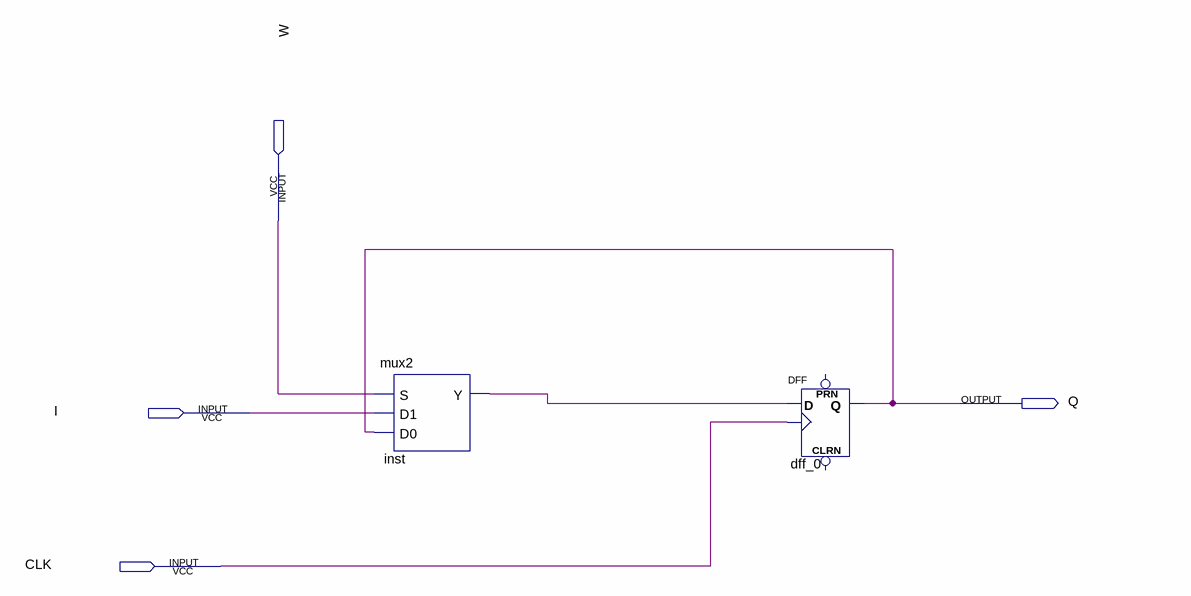
[diagram p0: schematic sheet]
// Quartus schematic register_1bit.bdf as structural Verilog: 2 symbols, 4 pins
module register_1bit (
  input  W,
  input  I,
  input  CLK,
  output Q
);

  wire inst_y;

  mux2 inst (.S(W), .D1(I), .D0(Q), .Y(inst_y));
  DFF dff_0 (.CLK(CLK), .D(inst_y), .Q(Q));  // open: CLRN, PRN
endmodule
